# EAGLE design Druga płytka (EAGLE 9.6.2)
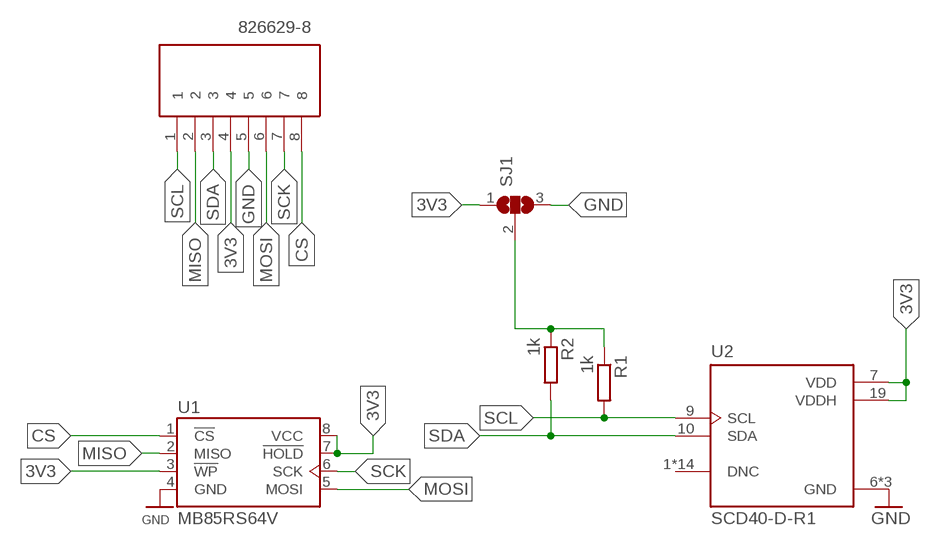
[diagram p0: schematic, sheet 1]

## Parts
J1  826629-8  [HDRV8W63P0X254_1X8_2032X250X95]
R1  1k  R-EU_0204/2V  [0204V]
R2  1k  R-EU_0204/2V  [0204V]
SJ1  SJ2W  [SJ_2]
U1  MB85RS64V  [SOIC127P600X155-8_R159_68_374R15]
U2  SCD40-D-R1  [XDCR_SCD40-D-R1]

## Nets
3V3: J1.4 SJ1.1 U1.3(!WP) U1.7(!HOLD) U1.8(VCC) U2.7(VDD) U2.19(VDDH)
CS: J1.8 U1.1(!CS)
GND: J1.5 SJ1.3 U1.4(GND) U2.6(GND) U2.20(GND) U2.21(GND)
JUMPER: R1.1 R2.1 SJ1.2
MISO: J1.2 U1.2(MISO)
MOSI: J1.6 U1.5(MOSI)
SCK: J1.7 U1.6(SCK)
SCL: J1.1 R1.2 U2.9(SCL)
SDA: J1.3 R2.2 U2.10(SDA)
Unconnected: U2.1(DNC) U2.2(DNC) U2.3(DNC) U2.4(DNC) U2.5(DNC) U2.8(DNC) U2.11(DNC) U2.12(DNC) U2.13(DNC) U2.14(DNC) U2.15(DNC) U2.16(DNC) U2.17(DNC) U2.18(DNC)

## Library data of the parts
J1 = 826629-8:826629-8: Body Features: Primary Product Color Green | Configuration Features: Number of Positions 8 | Board-to-Board Configuration Parallel | PCB Mount Orientation Vertical | Number of Rows 1 | Connector Contact Load Condition Fully Loaded | Contact Features: Mating Square Post Dimension .025 INCH | Contact Type Pin | Contact Underplating Material Nickel | Contact Mating Area Plating Material Gold or Gold Flash over Palladium Nickel | Mating Square Post Dimension .63 MM | Contact Shape & Form Square | Contact Mating Source: Datasheet <http://www.te.com/commerce/DocumentDelivery/DDEController?Action=showdoc&DocId=Customer Drawing826629AApdfEnglishENG_CD_826629_AA_baseFilename.pdf826629-8.pdf>; DESCRIPTION: Body Features: Primary Product Color Green | Configuration Features: Number of Positions 8 | Board-to-Board Configuration Parallel | PCB Mount Orientation Vertical | Number of Rows 1 | Connector Contact Load Condition Fully Loaded | Contact Features: Mating Square Post Dimension .025 INCH | Contact Type Pin | Contact Underplating Material Nickel | Contact Mating Area Plating Material Gold or Gold Flash over Palladium Nickel | Mating Square Post Dimension .63 MM | Contact Shape & Form Square | Contact Mating; HEIGHT: 9.5mm; MANUFACTURER_NAME: TE Connectivity; MANUFACTURER_PART_NUMBER: 826629-8; MOUSER_PART_NUMBER: 571-826629-8; MOUSER_PRICE-STOCK: https://www.mouser.co.uk/ProductDetail/TE-Connectivity/826629-8?qs=FazuUmncXokWopYWOwxkcA%3D%3D
R1 R2 = rcl:R-EU_: RESISTOR, European symbol; SPICEPREFIX: R
SJ1 = jumper:SJ2W: SMD solder JUMPER
U1 = MB85RS64V (1):MB85RS64V: Check availability <https://pricing.snapeda.com/parts/MB85RS64V/Fujitsu/view-part?ref=eda>; AVAILABILITY: Not in stock; CHECK_PRICES: https://www.snapeda.com/parts/MB85RS64V/Fujitsu/view-part/?ref=eda; DESCRIPTION: FRAM (Ferroelectric RAM) Memory IC 64Kb (8K x 8) SPI 20 MHz 8-SOP; MF: Fujitsu; MP: MB85RS64V; PACKAGE: None; PRICE: None; SNAPEDA_LINK: https://www.snapeda.com/parts/MB85RS64V/Fujitsu/view-part/?ref=snap
U2 = SCD40-D-R1:SCD40-D-R1: Check availability <https://pricing.snapeda.com/parts/SCD40-D-R1/Sensirion%20AG/view-part?ref=eda>; AVAILABILITY: In Stock; CHECK_PRICES: https://www.snapeda.com/parts/SCD40-D-R1/Sensirion/view-part/?ref=eda; DESCRIPTION: Carbon Dioxide (CO2), Humidity, Temperature Sensor I2C; MF: Sensirion AG; MP: SCD40-D-R1; PACKAGE: None; PRICE: None; SNAPEDA_LINK: https://www.snapeda.com/parts/SCD40-D-R1/Sensirion/view-part/?ref=snap

## Board
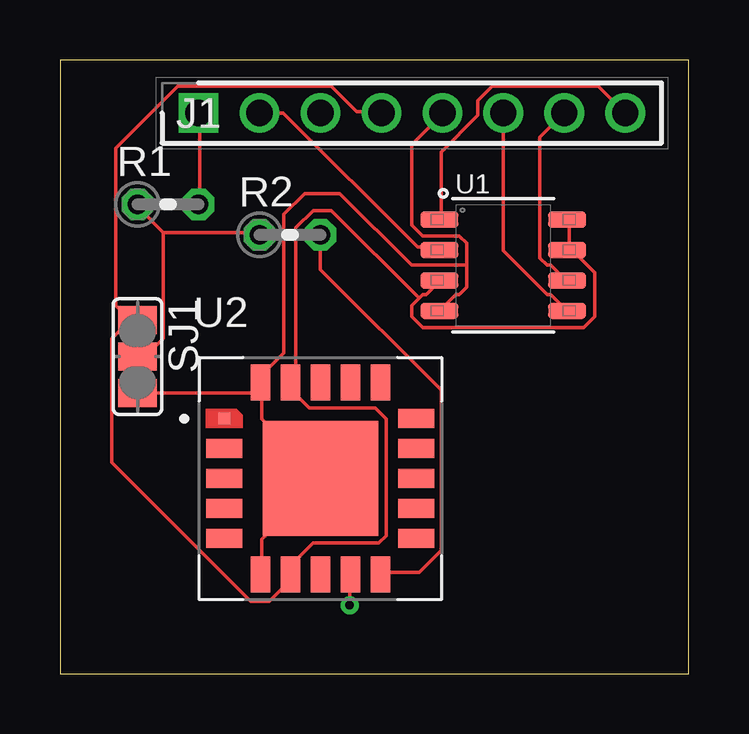
[diagram p1: board, top side]
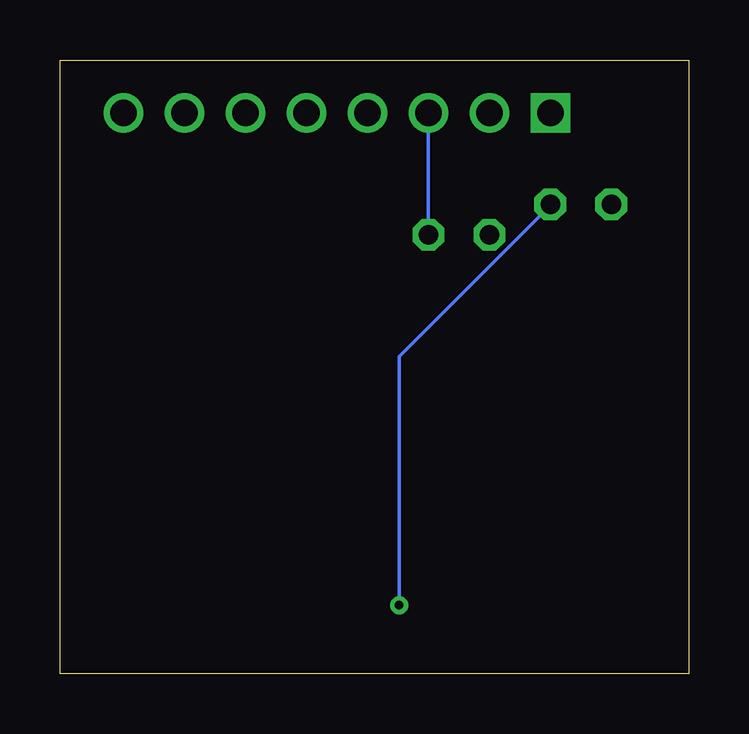
[diagram p2: board, bottom side, seen from below]

Size 26.2 x 25.6 mm. Coordinates in mm from the lower left corner, seen from the top.
Outline: 0,0 26.2,0 26.2,25.6 0,25.6 0,0
Copper layers (1*16): Top 0.035mm / dielectric 1.5mm / Bottom 0.035mm
Design rules "default": minimum track width 6mil, minimum drill 0.35mm, track to track 6mil, track to pad 6mil, pad to pad 6mil, via to via 6mil, smd to smd 6mil, copper to edge 40mil, drill to drill 6mil, minimum pad ring 10mil, minimum via ring 8mil, stop-mask expansion 4mil, vias tented up to drill 0mil, thermal gap 10mil

### Footprints (pad centres in the part's own frame; a part is rotated, then mirrored left to right if it is on the bottom)
HDRV8W63P0X254_1X8_2032X250X95 = drill 1.1 pad 1.65 square: 1 0,0 | drill 1.1 pad 1.65: 2 2.54,0; 3 5.08,0; 4 7.62,0; 5 10.16,0; 6 12.7,0; 7 15.24,0; 8 17.78,0
0204V = drill 0.813 octagon: 1 -1.27,0; 2 1.27,0
SJ_2 = smd 1.168 x 1.6: 1 -1.524,0; 2 0,0; 3 1.524,0
SOIC127P600X155-8_R159_68_374R15 = smd 1.59 x 0.68: 1 -2.665,1.905; 2 -2.665,0.635; 3 -2.665,-0.635; 4 -2.665,-1.905; 5 2.665,-1.905; 6 2.665,-0.635; 7 2.665,0.635; 8 2.665,1.905
XDCR_SCD40-D-R1 = smd 0.5 x 0.5: 1 -4,2.5 | smd 1.5 x 0.8: 2 -4,1.25; 3 -4,0; 4 -4,-1.25; 5 -4,-2.5; 11 4,-2.5; 12 4,-1.25; 13 4,0; 14 4,1.25; 15 4,2.5 | smd 0.8 x 1.5: 6 -2.5,-4; 7 -1.25,-4; 8 0,-4; 9 1.25,-4; 10 2.5,-4; 16 2.5,4; 17 1.25,4; 18 0,4; 19 -1.25,4; 20 -2.5,4 | smd 4.8 x 4.8: 21 0,0

### Placement (x,y rotation side)
J1  5.77,23.39 0 top
R1  4.5,19.58 0 top
R2  9.58,18.31 0 top
SJ1  3.23,13.23 270 top
U1  18.47,17.04 0 top
U2  10.85,8.15 0 top

### Tracks (layer width: path | path; a pad name or v marks a point on that pad's centre or on a via)
3V3
  Top 0.152: 14.96,15.67 14.66,15.36 14.66,14.91 15.12,14.45 21.82,14.45 22.28,14.91 22.28,16.73 21.21,17.8 | 14.96,15.67 15.12,15.82 15.27,15.82 15.73,16.28 U1.3 | 21.21,17.8 21.21,18.87 U1.8 | 21.21,17.8 U1.7 | 2.93,14.75 2.16,13.99 2.16,8.81 7.95,3.02 8.72,3.02 9.48,3.78 9.48,4.09 U2.7 9.63,4.24 9.63,4.54 10.55,5.46 13.29,5.46 13.59,5.76 13.59,10.64 13.14,11.1 10.39,11.1 9.48,12.01 U2.19 9.83,12.25 9.83,18.61 10.55,19.33 11.31,19.33 14.96,15.67 | 2.93,14.75 2.32,15.36 2.32,21.92 4.91,24.51 11.31,24.51 12.37,23.44 13.29,23.44 J1.4 | 2.93,14.75 SJ1.1
CS
  Top 0.152: J1.8 22.43,24.51 18.01,24.51 17.4,23.9 17.4,23.29 15.88,21.76 15.88,19.02 U1.1
GND
  Top 0.152: 16.95,17.04 16.95,17.95 16.64,18.26 15.12,18.26 14.66,18.72 14.66,22.07 15.88,23.29 J1.5 | 16.95,17.04 16.95,16.13 16.64,15.82 16.49,15.82 15.88,15.21 U1.4 | U2.6 8.41,4.24 8.41,5.61 10.85,8.05 U2.21 10.85,8.2 8.41,10.64 8.41,11.71 | 8.41,11.71 8.41,12.01 U2.20 | 8.41,11.71 SJ1.3 | 8.41,11.71 U2.20 | 16.95,17.04 14.65,17.04 11.66,20.03 10.19,20.03 9.33,19.16 9.33,13.38 8.41,12.47 8.41,12.16 U2.20
JUMPER
  Top 0.152: SJ1.2 3.54,13.23 4.3,13.99 4.3,18.41 | 4.3,18.41 3.23,19.48 R1.1 | 4.3,18.41 8.26,18.41 R2.1
MISO
  Top 0.152: J1.2 9.31,23.39 14.9,17.8 15.73,17.8 U1.2
MOSI
  Top 0.152: J1.6 18.47,17.65 20.3,15.82 20.45,15.82 21.06,15.21 U1.5
SCK
  Top 0.152: J1.7 19.99,22.37 19.99,17.35 20.3,17.04 20.45,17.04 21.06,16.43 U1.6
SCL  (via drill 0.35)
  Top 0.152: v12.07,2.87 12.07,4.09 U2.9 | J1.1 5.82,23.29 5.82,19.63 R1.2
  Bottom 0.152: v12.07,2.87 12.07,13.23 5.82,19.48 R1.2
SDA
  Top 0.152: U2.10 13.44,4.24 14.96,4.24 15.88,5.15 15.88,11.83 10.85,16.86 R2.2
  Bottom 0.152: R2.2 J1.3